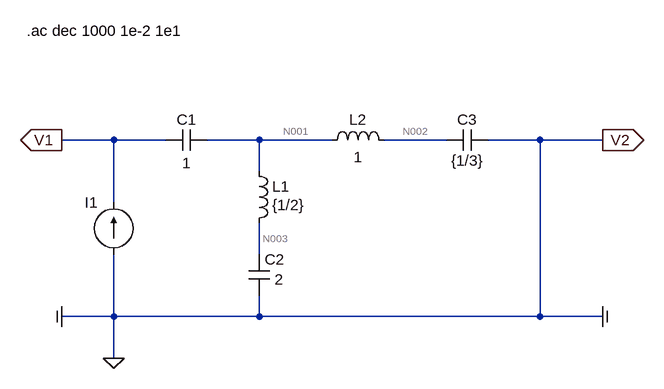
[diagram p0: schematic TS12_Ejercicio_1_LTSpice.asc]
TS12_Ejercicio_1_LTSpice.asc, the LTspice schematic file:
Version 4
SHEET 1 1024 680
WIRE 96 48 16 48
WIRE 176 48 96 48
WIRE 320 48 240 48
WIRE 432 48 320 48
WIRE 608 48 512 48
WIRE 752 48 672 48
WIRE 848 48 752 48
WIRE 320 96 320 48
WIRE 96 144 96 48
WIRE 320 224 320 176
WIRE 96 320 96 224
WIRE 96 320 16 320
WIRE 320 320 320 288
WIRE 320 320 96 320
WIRE 752 320 752 48
WIRE 752 320 320 320
WIRE 848 320 752 320
WIRE 96 384 96 320
FLAG 848 48 V2
IOPIN 848 48 Out
FLAG 16 48 V1
IOPIN 16 48 Out
FLAG 96 384 0
FLAG 16 320 COM
IOPIN 16 320 Out
FLAG 848 320 COM
IOPIN 848 320 Out
SYMBOL cap 240 32 R90
WINDOW 0 0 32 VBottom 2
WINDOW 3 67 32 VBottom 2
SYMATTR InstName C1
SYMATTR Value 1
SYMBOL cap 304 224 R0
WINDOW 3 40 39 Left 2
SYMATTR InstName C2
SYMATTR Value 2
SYMBOL ind 304 80 R0
WINDOW 3 36 68 Left 2
SYMATTR InstName L1
SYMATTR Value {1/2}
SYMBOL ind 416 64 R270
WINDOW 0 32 56 VTop 2
WINDOW 3 5 56 VBottom 2
SYMATTR InstName L2
SYMATTR Value 1
SYMBOL cap 672 32 R90
WINDOW 0 0 32 VBottom 2
WINDOW 3 32 32 VTop 2
SYMATTR InstName C3
SYMATTR Value {1/3}
SYMBOL current 96 224 R180
WINDOW 0 24 80 Left 2
WINDOW 3 24 0 Left 2
WINDOW 39 0 0 Left 0
SYMATTR InstName I1
SYMATTR Value ""
SYMATTR Value2 AC 1 0
TEXT -38 -120 Left 2 !.ac dec 1000 1e-2 1e1

The netlist it stands for:
* TS12_Ejercicio_1_LTSpice.asc
C1 N001 V1 1
C2 N003 0 2
L1 N001 N003 {1/2}
L2 N001 N002 1
C3 0 N002 {1/3}
I1 0 V1 AC 1 0
.ac dec 1000 1e-2 1e1
.backanno
.end

* Results of the author's LTspice run, read from the files saved beside the schematic
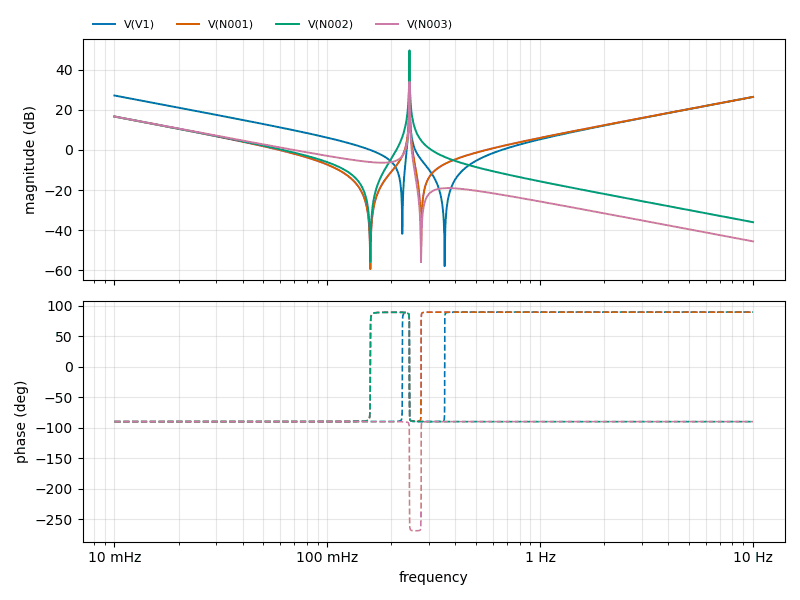
[diagram p1: AC Analysis of TS12_Ejercicio_1_LTSpice.asc, plotted from the saved traces]
* AC Analysis, 1 run:
*   V(V1): 27.13 dB at 10 mHz, 26.41 dB at 10 Hz, peak 36.56 dB at 243.2 mHz, 3 dB below the peak at 243.1 mHz and 243.4 mHz
*   V(N001): 16.65 dB at 10 mHz, 26.42 dB at 10 Hz, peak 36.50 dB at 243.2 mHz, 3 dB below the peak at 243 mHz and 243.3 mHz
*   V(N002): 16.66 dB at 10 mHz, -35.96 dB at 10 Hz, peak 49.59 dB at 243.2 mHz, 3 dB below the peak at 243 mHz and 243.4 mHz
*   V(N003): 16.68 dB at 10 mHz, -45.51 dB at 10 Hz, peak 33.99 dB at 243.2 mHz, 3 dB below the peak at 243 mHz and 243.3 mHz